# EAGLE design TCCBot_Shield (EAGLE 5.11)
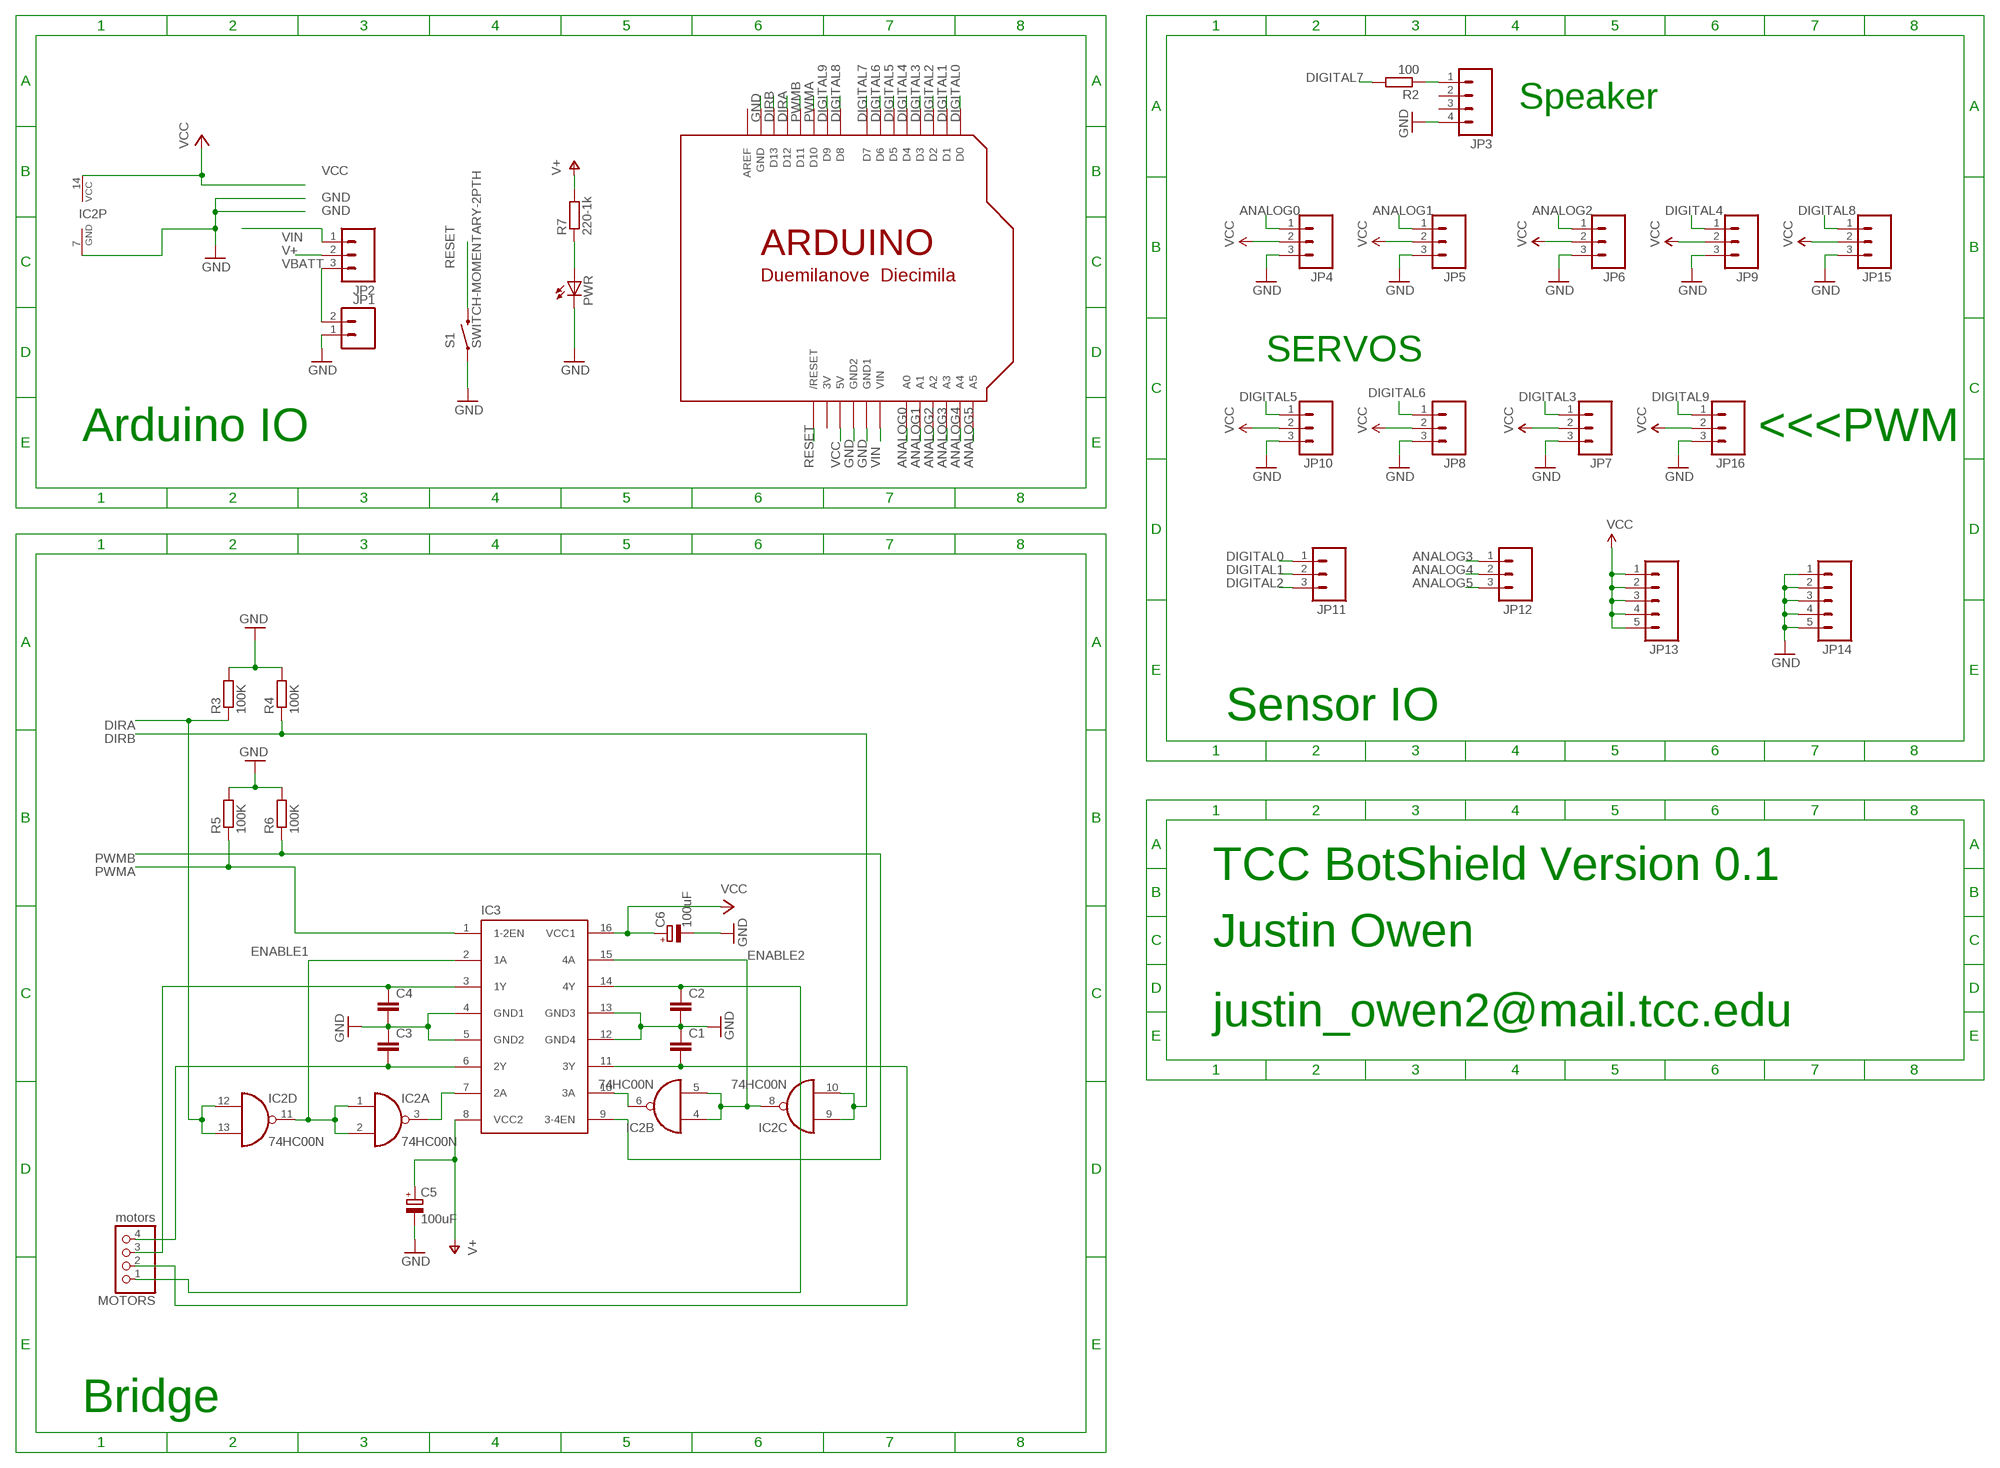
[diagram p0: schematic, sheet 1]

## Parts
C1  C5/5.5  [C5B5.5]
C2  C5/5.5  [C5B5.5]
C3  C5/5.5  [C5B5.5]
C4  C5/5.5  [C5B5.5]
C5  100uF  CPOL-EUE2.5-5  [E2,5-5]
C6  100uF  CPOL-EUE2.5-5  [E2,5-5]
IC2  74HC00N  [DIL14]
IC3  L293E  [DIL16]
JP1  M023.5MM  [SCREWTERMINAL-3.5MM-2]
JP2  M03PTH  [1X03]
JP3  M04PTH  [1X04]
JP4  M03PTH  [1X03]
JP5  M03PTH  [1X03]
JP6  M03PTH  [1X03]
JP7  M03PTH  [1X03]
JP8  M03PTH  [1X03]
JP9  M03PTH  [1X03]
JP10  M03PTH  [1X03]
JP11  M03PTH  [1X03]
JP12  M03PTH  [1X03]
JP13  M05PTH  [1X05]
JP14  M05PTH  [1X05]
JP15  M03PTH  [1X03]
JP16  M03PTH  [1X03]
MOTORS  motors  PINHD-1X4  [1X04]
PWR  LED3MM  [LED3MM]
R2  100  R-EU_0204/7  [0204/7]
R3  100K  R-EU_0204/7  [0204/7]
R4  100K  R-EU_0204/7  [0204/7]
R5  100K  R-EU_0204/7  [0204/7]
R6  100K  R-EU_0204/7  [0204/7]
R7  220-1k  R-EU_0204/7  [0204/7]
S1  SWITCH-MOMENTARY-2PTH  [TACTILE-PTH]
U$1  ARDUINOUNO  [ARDUINO]

## Nets
ANALOG0 [io]: JP4.1 U$1.A0
ANALOG1 [io]: JP5.1 U$1.A1
ANALOG2 [io]: JP6.1 U$1.A2
ANALOG3 [io]: JP12.1 U$1.A3
ANALOG4 [io]: JP12.2 U$1.A4
ANALOG5 [io]: JP12.3 U$1.A5
DIGITAL0 [io]: JP11.1 U$1.D0
DIGITAL1 [io]: JP11.2 U$1.D1
DIGITAL2 [io]: JP11.3 U$1.D2
DIGITAL3 [io]: JP7.1 U$1.D3
DIGITAL4 [io]: JP9.1 U$1.D4
DIGITAL5 [io]: JP10.1 U$1.D5
DIGITAL6 [io]: JP8.1 U$1.D6
DIGITAL7 [io]: R2.2 U$1.D7
DIGITAL8 [io]: JP15.1 U$1.D8
DIGITAL9 [io]: JP16.1 U$1.D9
DIRA [io]: IC2.12(D:I0) IC2.13(D:I1) R3.1 U$1.D12
DIRB [io]: IC2.9(C:I0) IC2.10(C:I1) R4.1 U$1.D13
ENABLE1: IC2.1(A:I0) IC2.2(A:I1) IC2.11(D:O) IC3.2(1A)
ENABLE2: IC2.4(B:I0) IC2.5(B:I1) IC2.8(C:O) IC3.15(4A)
GND [io]: C1.1 C2.2 C3.1 C4.2 C5.- C6.- IC2.7(P:GND) IC3.4(GND1) IC3.5(GND2) IC3.12(GND4) IC3.13(GND3) JP1.1 JP3.4 JP4.3 JP5.3 JP6.3 JP7.3 JP8.3 JP9.3 JP10.3 JP14.1 JP14.2 JP14.3 JP14.4 JP14.5 JP15.3 JP16.3 PWR.K(C) R3.2 R4.2 R5.2 R6.2 S1.1 U$1.GND U$1.GND1 U$1.GND2
N$1 [io]: JP3.1 R2.1
N$30: C4.1 IC3.3(1Y) MOTORS.3
N$31: C3.2 IC3.6(2Y) MOTORS.4
N$32: C1.2 IC3.11(3Y) MOTORS.2
N$33: C2.1 IC3.14(4Y) MOTORS.1
N$35: PWR.A R7.1
N$44: IC2.6(B:O) IC3.10(3A)
N$45: IC2.3(A:O) IC3.7(2A)
PWMA [io]: IC3.1(1-2EN) R5.1 U$1.D10
PWMB [io]: IC3.9(3-4EN) R6.1 U$1.D11
RESET: S1.3 U$1.RESET(/RESET)
V+ [power]: C5.+ IC3.8(VCC2) JP2.2 R7.2
VBATT [power]: JP1.2 JP2.3
VCC [io]: C6.+ IC2.14(P:VCC) IC3.16(VCC1) JP4.2 JP5.2 JP6.2 JP7.2 JP8.2 JP9.2 JP10.2 JP13.1 JP13.2 JP13.3 JP13.4 JP13.5 JP15.2 JP16.2 U$1.5V
VIN [power]: JP2.1 U$1.VIN
Unconnected: JP3.2 JP3.3 U$1.AREF

## Notes on the sheet
- Speaker
- SERVOS
- Arduino IO | <<<PWM
- Sensor IO
- TCC BotShield Version 0.1
- Justin Owen
- justin_owen2@mail.tcc.edu
- Bridge

## Power pins joined to a net without a drawn wire
3V: U$1.3V

## Library data of the parts
C1-C4 = capacitor-wima:C: CAPACITOR naming: grid - package width
C5 C6 = rcl:CPOL-EU: POLARIZED CAPACITOR, European symbol
IC2 = 74xx-eu:74*00: Quad 2-input NAND gate
IC3 = texas:L293E: TI DEVICE; MF: Arrow Electronics; MPN: L293E; OC_FARNELL: 1467711; OC_NEWARK: 89K0732
JP1 = SparkFun:M02: Header 2 Standard 2-pin 0.1" header. Use with straight break away headers (SKU : PRT-00116), right angle break away headers (PRT-00553), swiss pins (PRT-00743), machine pins (PRT-00117), and female headers (PRT-00115). Molex polarized connector foot print use with SKU : PRT-08233 with associated crimp pins and housings.
JP2 JP4-JP12 JP15 JP16 = SparkFun:M03: Header 3 Standard 3-pin 0.1" header. Use with straight break away headers (SKU : PRT-00116), right angle break away headers (PRT-00553), swiss pins (PRT-00743), machine pins (PRT-00117), and female headers (PRT-00115). Molex polarized connector foot print use with SKU : PRT-08232 with associated crimp pins and housings.
JP3 = SparkFun:M04: Header 4 Standard 4-pin 0.1" header. Use with straight break away headers (SKU : PRT-00116), right angle break away headers (PRT-00553), swiss pins (PRT-00743), machine pins (PRT-00117), and female headers (PRT-00115). Molex polarized connector foot print use with SKU : PRT-08231 with associated crimp pins and housings. 1MM SMD Version SKU: PRT-10208
JP13 JP14 = SparkFun:M05: Header 5 Standard 5-pin 0.1" header. Use with straight break away headers (SKU : PRT-00116), right angle break away headers (PRT-00553), swiss pins (PRT-00743), machine pins (PRT-00117), and female headers (PRT-00115). Molex polarized connector foot print use with SKU : PRT-08230 with associated crimp pins and housings.
MOTORS = pinhead:PINHD-1X4: PIN HEADER
PWR = led:LED: LED OSRAM: - CHIPLED LG R971, LG N971, LY N971, LG Q971, LY Q971, LO R971, LY R971 LH N974, LH R974 LS Q976, LO Q976, LY Q976 LO Q996 - Hyper CHIPLED LW Q18S LB Q993, LB Q99A, LB R99A - SideLED LS A670, LO A670, LY A670, LG A670, LP A670 LB A673, LV A673, LT A673, LW A673 LH A674 LY A675 LS A676, LA A676, LO A676, LY A676, LW A676 LS A679, LY A679, LG A679 - Hyper Micro SIDELED® LS Y876, LA Y876, LO Y876, LY Y876 LT Y87S - SmartLED LW L88C, LW L88S LB L89C, LB L89S, LG L890 LS L89K, LO L89K, LY L89K LS L896, LA L896, LO L896, LY L896 - TOPLED LS T670, LO T670, LY T670, LG T670, LP T670 LSG T670, LSP T670, LSY T670, LOP T670, LYG T670 LG T671, LOG T671, LSG T671 LB T673, LV T673, LT T673, LW T673 LH T674 LS T676, LA T676, LO T676, LY T676, LB T676, LH T676, LSB T676, LW T676 LB T67C, LV T67C, LT T67C, LS T67K, LO T67K, LY T67K, LW E67C LS E67B, LA E67B, LO E67B, LY E67B, LB E67C, LV E67C, LT E67C LW T67C LS T679, LY T679, LG T679 LS T770, LO T770, LY T770, LG T770, LP T770 LB T773, LV T773, LT T773, LW T773 LH T774 LS E675, LA E675, LY E675, LS T675 LS T776, LA T776, LO T776, LY T776, LB T776 LHGB T686 LT T68C, LB T68C - Hyper Mini TOPLED® LB M676 - Mini TOPLED Santana® LG M470 LS M47K, LO M47K, LY M47K Source: http://www.osram.convergy.de LUXEON: - LUMILED® LXK2-PW12-R00, LXK2-PW12-S00, LXK2-PW14-U00, LXK2-PW14-V00 LXK2-PM12-R00, LXK2-PM12-S00, LXK2-PM14-U00 LXK2-PE12-Q00, LXK2-PE12-R00, LXK2-PE12-S00, LXK2-PE14-T00, LXK2-PE14-U00 LXK2-PB12-K00, LXK2-PB12-L00, LXK2-PB12-M00, LXK2-PB14-N00, LXK2-PB14-P00, LXK2-PB14-Q00 LXK2-PR12-L00, LXK2-PR12-M00, LXK2-PR14-Q00, LXK2-PR14-R00 LXK2-PD12-Q00, LXK2-PD12-R00, LXK2-PD12-S00 LXK2-PH12-R00, LXK2-PH12-S00 LXK2-PL12-P00, LXK2-PL12-Q00, LXK2-PL12-R00 Source: www.luxeon.com KINGBRIGHT: KA-3528ASYC Source: www.kingbright.com
R2-R7 = rcl:R-EU_: RESISTOR, European symbol
S1 = SparkFun:SWITCH-MOMENTARY-2
U$1 = adafruit:ARDUINO: Arduino Diecimila/Duemilanove Make a shield with ease, this package has all the named pins as well as the two mounting drill holes and an outline of the USB and DC power connector. The outline is on the DIMENSION layer, so if your board house uses it they will cut the outline to match. http://www.ladyada.net/library/pcb/eaglelibrary.html

## Net classes
0 $GND: width 0.508 mm, clearance 0.635 mm
1 power: width 0.889 mm, clearance 0.635 mm
2 io: width 0.381 mm, clearance 0.305 mm

## Board
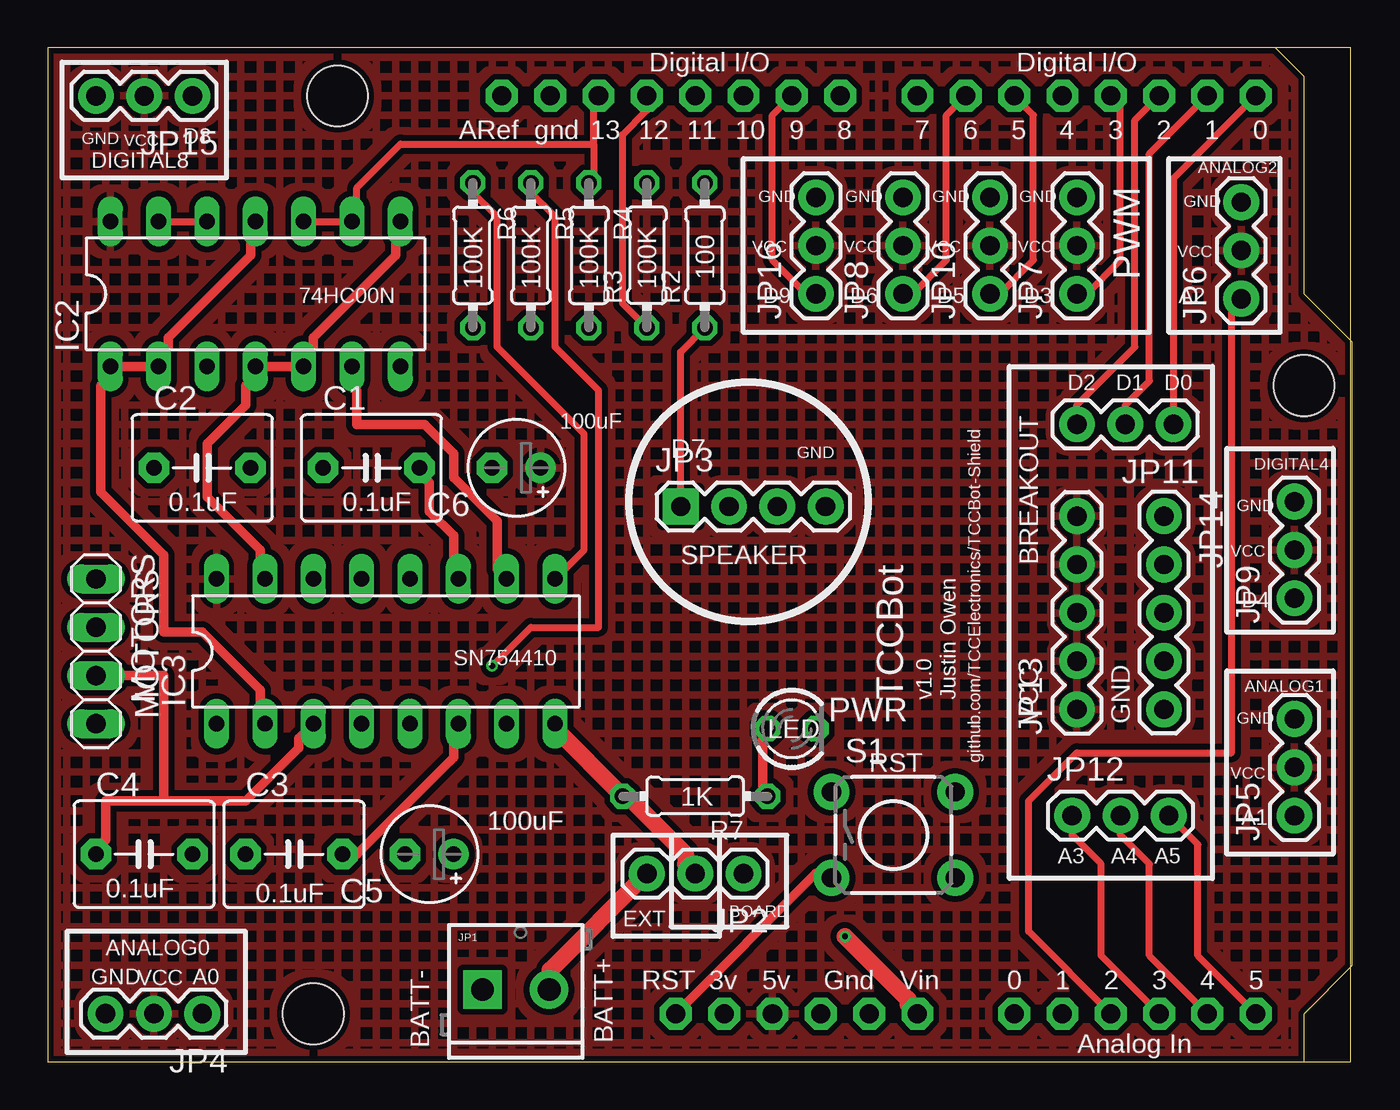
[diagram p1: board, top side]
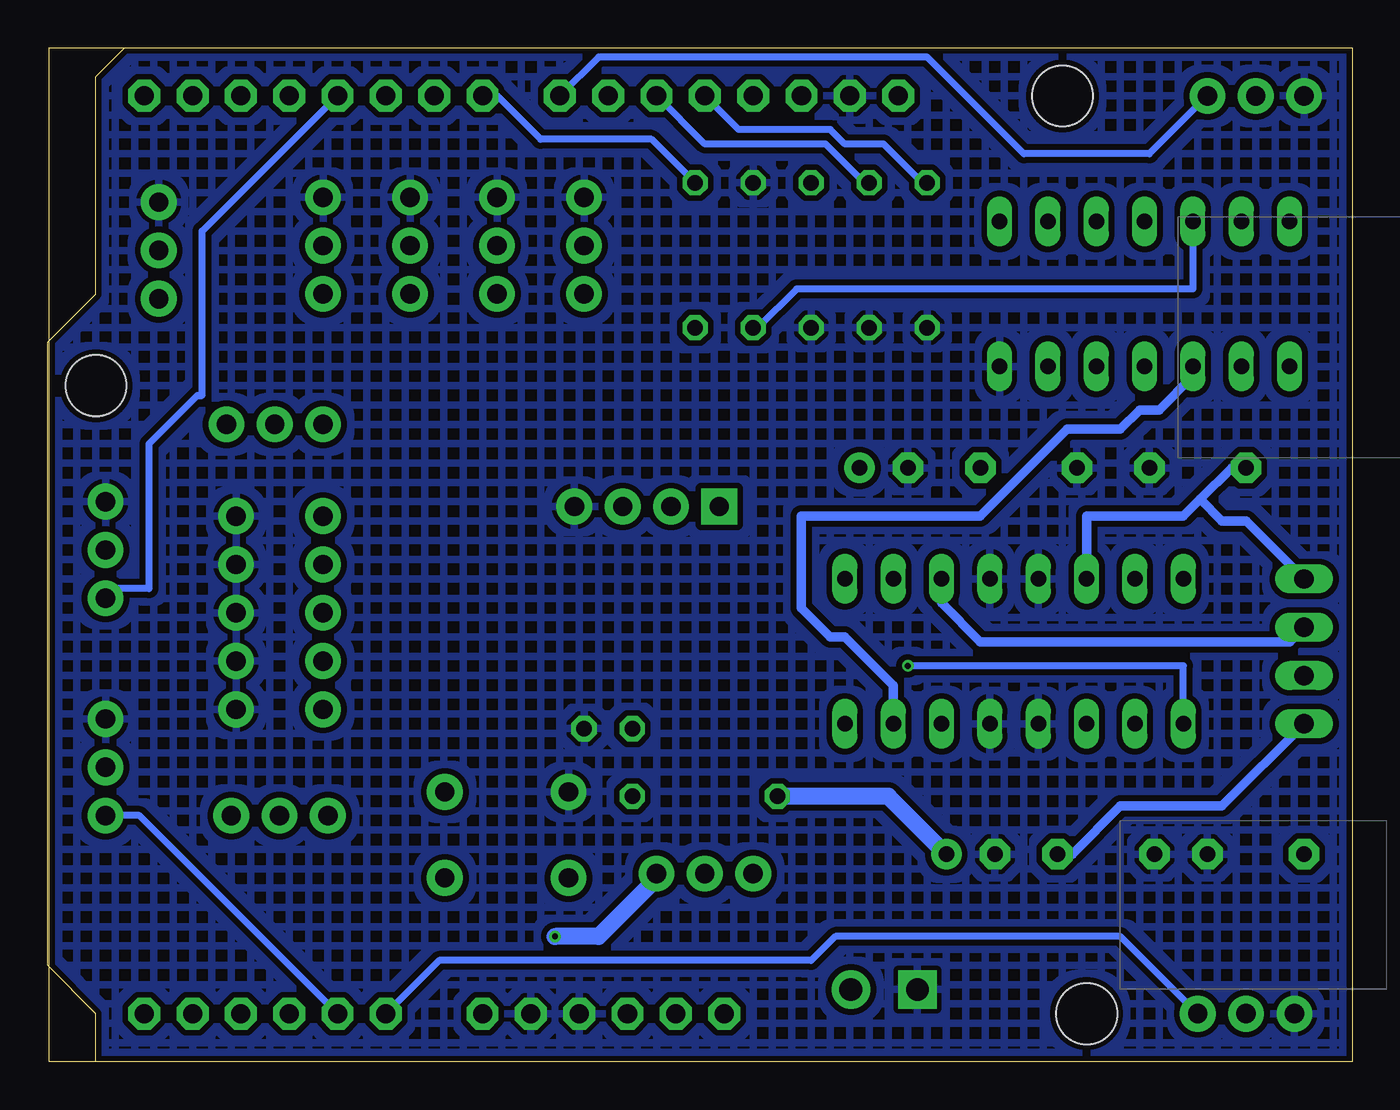
[diagram p2: board, bottom side, seen from below]

Size 68.58 x 53.34 mm. Coordinates in mm from the lower left corner, seen from the top.
Outline: 0,0 68.5,0 68.5,53.33 0,53.33
Copper layers (1*16): Top 0.035mm / dielectric 1.5mm / Bottom 0.035mm
Design rules "Fusion_eagle_rule_v1.1": minimum track width 6mil, minimum drill 12mil, track to track 6mil, track to pad 6mil, pad to pad 6mil, via to via 6mil, smd to smd 0mil, copper to edge 10mil, drill to drill 10mil, minimum pad ring 10mil, minimum via ring 6mil, stop-mask expansion 2mil, vias tented up to drill 100mil, thermal gap 10mil

### Footprints (pad centres in the part's own frame; a part is rotated, then mirrored left to right if it is on the bottom)
C5B5.5 = drill 0.813 pad 1.6 octagon: 1 -2.54,0; 2 2.54,0
E2,5-5 = drill 0.813 pad 1.6 round: + -1.27,0 | drill 0.813 pad 1.6 octagon: - 1.27,0
DIL14 = drill 0.813 long: 1 -7.62,-3.81; 2 -5.08,-3.81; 3 -2.54,-3.81; 4 0,-3.81; 5 2.54,-3.81; 6 5.08,-3.81; 7 7.62,-3.81; 8 7.62,3.81; 9 5.08,3.81; 10 2.54,3.81; 11 0,3.81; 12 -2.54,3.81; 13 -5.08,3.81; 14 -7.62,3.81
DIL16 = drill 0.813 long: 1 -8.89,-3.81; 2 -6.35,-3.81; 3 -3.81,-3.81; 4 -1.27,-3.81; 5 1.27,-3.81; 6 3.81,-3.81; 7 6.35,-3.81; 8 8.89,-3.81; 9 8.89,3.81; 10 6.35,3.81; 11 3.81,3.81; 12 1.27,3.81; 13 -1.27,3.81; 14 -3.81,3.81; 15 -6.35,3.81; 16 -8.89,3.81
SCREWTERMINAL-3.5MM-2 = drill 1.2 pad 2.032 square: 1 0,0 | drill 1.2 pad 2.032 round: 2 3.5,0
1X03 = drill 1.016 pad 1.88 round: 1 0,0; 2 2.54,0; 3 5.08,0
1X04 = drill 1.016 pad 1.88 square: 1 0,0 | drill 1.016 pad 1.88 round: 2 2.54,0; 3 5.08,0; 4 7.62,0
1X05 = drill 1.016 pad 1.88 round: 1 0,0; 2 2.54,0; 3 5.08,0; 4 7.62,0; 5 10.16,0
1X04' = drill 1.016 long: 1 -3.81,0; 2 -1.27,0; 3 1.27,0; 4 3.81,0
LED3MM = drill 0.813 octagon: A -1.27,0; K 1.27,0
0204/7 = drill 0.813 octagon: 1 -3.81,0; 2 3.81,0
TACTILE-PTH = drill 1.016 pad 1.88 round: 1 -3.251,2.261; 2 3.251,2.261; 3 -3.251,-2.261; 4 3.251,-2.261
ARDUINO = drill 1 pad 1.676 octagon: 3V 35.56,2.54; 5V 38.1,2.54; A0 50.8,2.54; A1 53.34,2.54; A2 55.88,2.54; A3 58.42,2.54; A4 60.96,2.54; A5 63.5,2.54; AREF 23.876,50.8; D0 63.5,50.8; D1 60.96,50.8; D2 58.42,50.8; D3 55.88,50.8; D4 53.34,50.8; D5 50.8,50.8; D6 48.26,50.8; D7 45.72,50.8; D8 41.656,50.8; D9 39.116,50.8; D10 36.576,50.8; D11 34.036,50.8; D12 31.496,50.8; D13 28.956,50.8; GND 26.416,50.8; GND1 43.18,2.54; GND2 40.64,2.54; RESET 33.02,2.54; VIN 45.72,2.54 | hole 3.2: 15.24,50.8; 66.04,35.56; 13.97,2.54

### Placement (x,y rotation side)
C1  17.02,31.24 0 top
C2  8.13,31.24 0 top
C3  12.95,10.92 0 top
C4  5.08,10.92 0 top
C5  20.07,10.92 180 top
C6  24.64,31.24 180 top
IC2  10.92,40.39 0 top
IC3  17.78,21.59 0 top
JP1  22.86,3.81 0 top
JP2  36.58,9.91 180 top
JP3  33.27,29.21 0 top
JP4  8.13,2.54 180 top
JP5  65.53,12.95 90 top
JP6  62.74,40.13 90 top
JP7  54.1,40.39 90 top
JP8  44.96,40.39 90 top
JP9  65.53,24.38 90 top
JP10  49.53,40.39 90 top
JP11  59.18,33.53 180 top
JP12  53.85,12.95 0 top
JP13  54.1,18.54 90 top
JP14  58.67,28.7 270 top
JP15  7.62,50.8 180 top
JP16  40.39,40.39 90 top
MOTORS  motors  [1X04']  2.54,21.59 270 top
PWR  39.12,17.53 0 top
R2  34.54,42.42 90 top
R3  31.5,42.42 90 top
R4  28.45,42.42 270 top
R5  25.4,42.42 270 top
R6  22.35,42.42 270 top
R7  34.04,13.97 180 top
S1  44.45,11.94 0 top
U$1  0,0 0 top

### Tracks (layer width: path | path; a pad name or v marks a point on that pad's centre or on a via)
ANALOG0
  Bottom 0.381: U$1.A0 48.01,5.33 28.45,5.33 27.18,6.6 12.19,6.6 JP4.1
ANALOG1
  Bottom 0.381: U$1.A1 63.75,12.95 JP5.1
ANALOG2
  Top 0.381: U$1.A2 51.56,6.86 51.56,13.72 54.1,16.26 62.23,16.26 62.23,39.62 JP6.1
ANALOG3
  Top 0.381: U$1.A3 55.37,5.59 55.37,10.41 53.85,11.94 JP12.1
ANALOG4
  Top 0.381: U$1.A4 57.91,5.59 57.91,10.41 56.39,11.94 JP12.2
ANALOG5
  Top 0.381: U$1.A5 60.45,5.59 60.45,11.43 JP12.3
DIGITAL0
  Top 0.381: U$1.D0 59.18,46.48 JP11.1
DIGITAL1
  Top 0.381: U$1.D1 57.91,47.75 57.91,35.81 56.64,34.54 JP11.2
DIGITAL2
  Top 0.381: U$1.D2 57.15,49.53 57.15,37.59 54.1,34.54 JP11.3
DIGITAL3
  Top 0.381: U$1.D3 56.39,50.29 56.39,42.16 54.61,40.39 JP7.1
DIGITAL4
  Bottom 0.381: U$1.D4 60.45,43.69 60.45,35.05 60.71,35.05 63.25,32.51 63.25,24.89 65.02,24.89 JP9.1
DIGITAL5
  Top 0.381: U$1.D5 51.82,49.78 51.82,42.16 50.04,40.39 JP10.1
DIGITAL6
  Top 0.381: U$1.D6 47.24,49.78 47.24,42.16 45.47,40.39 JP8.1
DIGITAL7
  Bottom 0.381: R2.2 36.83,48.51 42.67,48.51 44.96,50.8 U$1.D7
DIGITAL8
  Bottom 0.381: U$1.D8 39.62,52.83 22.35,52.83 17.27,47.75 10.67,47.75 JP15.1
DIGITAL9
  Top 0.381: U$1.D9 38.1,49.78 38.1,42.16 39.88,40.39 JP16.1
DIRA
  Top 0.381: IC2.13 IC2.12 | R3.1 30.23,39.88 30.23,48.77 31.5,50.04 U$1.D12
  Bottom 0.381: IC2.12 8.38,40.64 29.21,40.64 31.24,38.61 R3.1
DIRB
  Top 0.381: IC2.10 IC2.9 16.26,44.45 16.26,45.97 18.54,48.26 28.7,48.26 | R4.1 28.7,46.48 28.7,48.26 | 28.7,48.26 28.7,50.55 U$1.D13
ENABLE1
  Top 0.508: IC3.2 11.18,18.03 11.18,19.56 8.13,22.61 6.1,22.61 6.1,26.67 2.79,29.97 2.79,35.56 3.3,36.07 IC2.1 IC2.2 5.84,37.08 6.35,37.59 6.35,38.1 10.67,42.42 10.67,43.94 IC2.11
ENABLE2
  Top 0.508: IC3.15 11.18,25.65 11.18,26.92 8.38,29.72 8.38,32.51 10.41,34.54 10.41,35.56 10.92,36.07 IC2.4 IC2.5 13.46,37.08 13.97,37.59 13.97,38.1 18.29,42.42 18.29,43.94 IC2.8
GND
  pour Bottom (isolate 0.305, hatched): -0.76,54.36 70.1,54.36 70.1,-1.52 -0.76,-1.52
N$1
  Top 0.381: R2.1 33.27,37.34 JP3.1
N$30
  Top 0.508: IC3.3 13.21,17.02 13.21,16.51 10.41,13.72 6.1,13.72 | 6.1,13.72 3.05,13.72 3.05,11.68 2.54,11.18 C4.1 | MOTORS.3 6.1,20.32 6.1,13.72
N$31
  Top 0.508: IC3.6 21.34,17.53 21.34,16 16.26,10.92 C3.2
  Bottom 0.508: MOTORS.4 6.86,13.46 12.19,13.46 14.73,10.92 C3.2
N$32
  Top 0.508: IC3.11 21.34,25.65 21.34,27.69 20.07,28.96 20.07,30.48 19.56,30.99 C1.2
  Bottom 0.508: MOTORS.2 3.3,22.1 19.56,22.1 21.59,24.13 IC3.11
N$33
  Bottom 0.508: IC3.14 13.97,28.7 8.89,28.7 8,29.59 | 8,29.59 6.35,31.24 C2.1 | MOTORS.1 5.59,28.45 6.86,28.45 8,29.59
N$35
  Top 0.508: R7.1 37.59,14.22 37.59,17.27 PWR.A
N$44
  Top 0.508: IC3.10 23.62,25.91 23.62,28.45 21.34,30.73 21.34,32 19.81,33.53 16.26,33.53 16.26,35.31 16,35.56 IC2.6
N$45
  Bottom 0.508: IC3.7 24.13,19.81 26.67,22.35 27.43,22.35 28.96,23.88 28.96,28.7 19.56,28.7 14.99,33.27 12.19,33.27 11.18,34.29 10.16,34.29 8.38,36.07 IC2.3
PWMA  (via drill 0.3)
  Top 0.381: v23.37,20.83 25.4,22.86 28.96,22.86 28.96,35.31 26.67,37.59 26.67,44.45 25.4,45.72 R5.1
  Bottom 0.381: IC3.1 8.89,20.83 v23.37,20.83 | U$1.D10 34.04,48.26 27.69,48.26 25.65,46.23 R5.1
PWMB
  Top 0.381: IC3.9 28.19,26.92 28.19,33.02 23.62,37.59 23.62,44.45 22.35,45.72 R6.1
  Bottom 0.381: U$1.D11 32.26,49.02 27.43,49.02 26.67,48.26 24.64,48.26 22.61,46.23 R6.1
RESET
  Top 0.508: U$1.RESET 40.39,9.91 41.15,9.91 S1.3
V+
  Top 0.889: IC3.8 26.67,17.53 R7.2 30.48,13.97 33.53,10.92 33.53,10.41 JP2.2
  Bottom 0.889: C5.+ 24.38,13.97 R7.2
VBATT
  Top 0.889: JP2.3 26.42,4.83 26.42,3.81 JP1.2
VCC
  pour Top (isolate 0.305, hatched): -2.03,55.63 71.88,55.63 71.88,-3.05 -2.03,-3.05
VIN  (via drill 0.3)
  Top 0.889: U$1.VIN 45.21,3.05 45.21,3.3 v41.91,6.6
  Bottom 0.889: v41.91,6.6 39.62,6.6 36.58,9.65 JP2.1

### Text on the board
tPlace: VCC | GND | D8 | DIGITAL8 | ANALOG2 | GND | GND | GND | GND | GND | VCC | VCC | VCC | VCC | VCC | 100K | 100K | 100K | 100K | 100 | PWM | 74HC00N | D9 | D6 | D5 | D3 | A2 | D2 | D1 | D0 | 100uF | D7 | GND | DIGITAL4 | 0.1uF | 0.1uF | GND | VCC | SPEAKER | BREAKOUT | D4 | SN754410 | ANALOG1 | TCCBot | v1.0 | Justin Owen | MOTORS | VCC | GND | GND | LED | github.com/TCCElectronics/TCCBot-Shield | RST | VCC | 1K | 100uF | A1 | A3 | A4 | A5 | 0.1uF | 0.1uF | BOARD | EXT | ANALOG0 | VCC | GND | A0 | BATT- | BATT+